# EAGLE design Netzteilplatine (EAGLE 7.7.0)
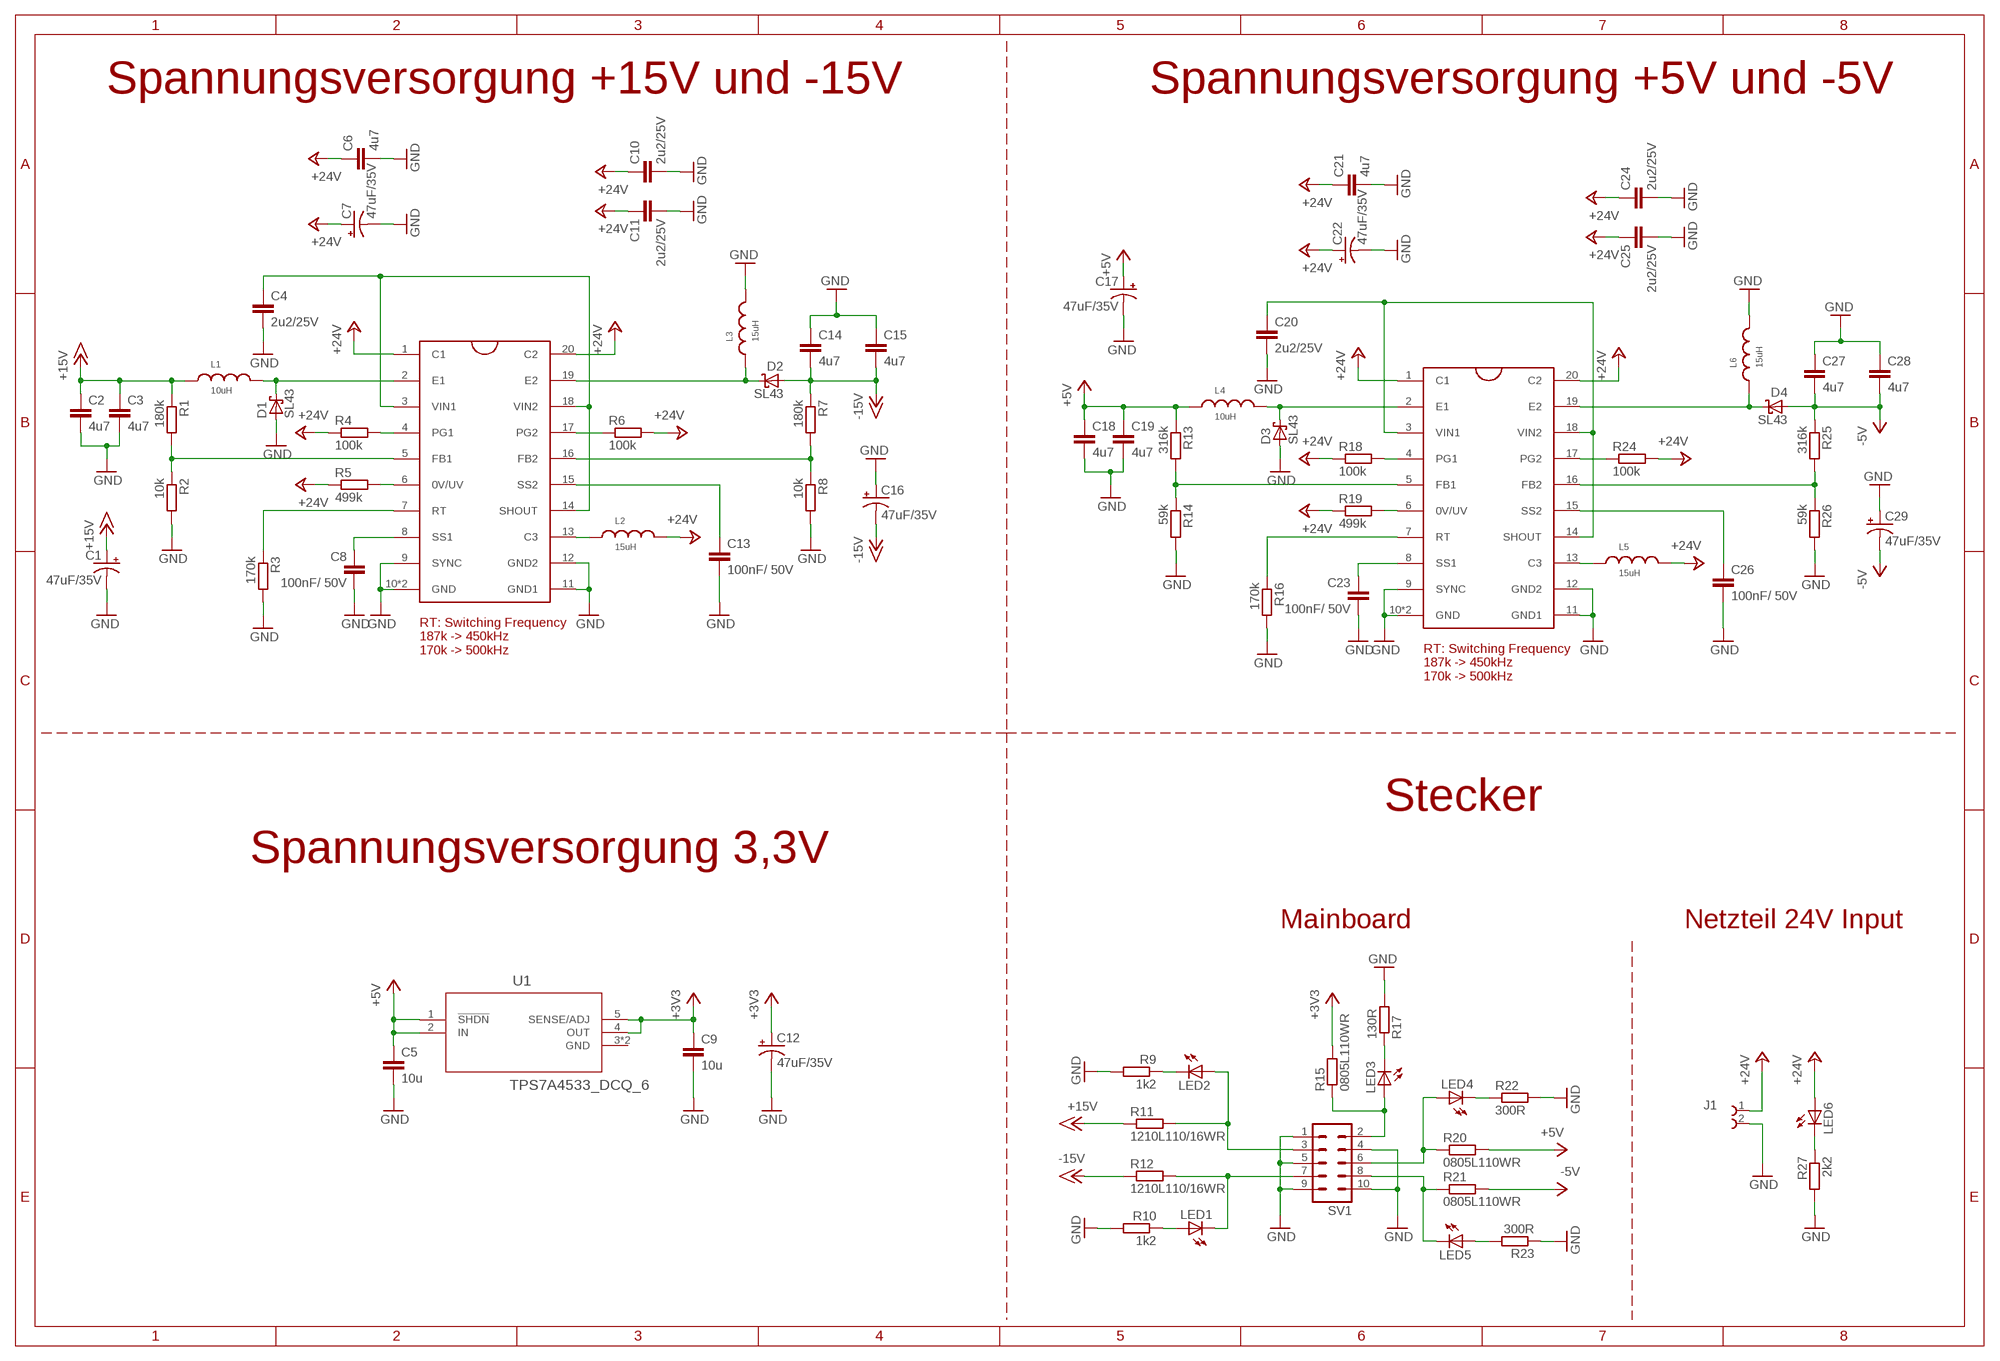
[diagram p0: schematic, sheet 1]

## Parts
C1  47uF/35V  CPOL-USD  [PANASONIC_D]
C2  4u7  C-EUC1210  [C1210]
C3  4u7  C-EUC1210  [C1210]
C4  2u2/25V  C-EUC1210  [C1210]
C5  10u  C-EUC0805  [C0805]
C6  4u7  C-EUC1210  [C1210]
C7  47uF/35V  CPOL-USD  [PANASONIC_D]
C8  100nF/ 50V  C-EUC0603  [C0603]
C9  10u  C-EUC0805  [C0805]
C10  2u2/25V  C-EUC1210  [C1210]
C11  2u2/25V  C-EUC1210  [C1210]
C12  47uF/35V  CPOL-USD  [PANASONIC_D]
C13  100nF/ 50V  C-EUC0603  [C0603]
C14  4u7  C-EUC1210  [C1210]
C15  4u7  C-EUC1210  [C1210]
C16  47uF/35V  CPOL-USD  [PANASONIC_D]
C17  47uF/35V  CPOL-USD  [PANASONIC_D]
C18  4u7  C-EUC1210  [C1210]
C19  4u7  C-EUC1210  [C1210]
C20  2u2/25V  C-EUC1210  [C1210]
C21  4u7  C-EUC1210  [C1210]
C22  47uF/35V  CPOL-USD  [PANASONIC_D]
C23  100nF/ 50V  C-EUC0603  [C0603]
C24  2u2/25V  C-EUC1210  [C1210]
C25  2u2/25V  C-EUC1210  [C1210]
C26  100nF/ 50V  C-EUC0603  [C0603]
C27  4u7  C-EUC1210  [C1210]
C28  4u7  C-EUC1210  [C1210]
C29  47uF/35V  CPOL-USD  [PANASONIC_D]
D1  SL43  SCHOTTKY-DIODESMC  [SMC]
D2  SL43  SCHOTTKY-DIODESMC  [SMC]
D3  SL43  SCHOTTKY-DIODESMC  [SMC]
D4  SL43  SCHOTTKY-DIODESMC  [SMC]
J1  691137810002  [691137810002]
L1  10uH  WE-PD_7332_PLASTIC_744778910  [WE-PD_7332-7345_PLASTIC_BASE]
L2  15uH  WE-PD2SR_7850_744787150  [WE-PD2SR_7850]
L3  15uH  WE-PD2SR_7850_744787150  [WE-PD2SR_7850]
L4  10uH  WE-PD_7332_PLASTIC_744778910  [WE-PD_7332-7345_PLASTIC_BASE]
L5  15uH  WE-PD2SR_7850_744787150  [WE-PD2SR_7850]
L6  15uH  WE-PD2SR_7850_744787150  [WE-PD2SR_7850]
LED1  LEDCHIPLED_0603  [CHIPLED_0603]
LED2  LEDCHIPLED_0603  [CHIPLED_0603]
LED3  LEDCHIPLED_0603  [CHIPLED_0603]
LED4  LEDCHIPLED_0603  [CHIPLED_0603]
LED5  LEDCHIPLED_0603  [CHIPLED_0603]
LED6  LEDCHIPLED_0603  [CHIPLED_0603]
R1  180k  R-EU_R0603  [R0603]
R2  10k  R-EU_R0603  [R0603]
R3  170k  R-EU_R0603  [R0603]
R4  100k  R-EU_R0603  [R0603]
R5  499k  R-EU_R0603  [R0603]
R6  100k  R-EU_R0603  [R0603]
R7  180k  R-EU_R0603  [R0603]
R8  10k  R-EU_R0603  [R0603]
R9  1k2  R-EU_R0603  [R0603]
R10  1k2  R-EU_R0603  [R0603]
R11  1210L110/16WR  R-EU_R1206  [R1206]
R12  1210L110/16WR  R-EU_R1206  [R1206]
R13  316k  R-EU_R0603  [R0603]
R14  59k  R-EU_R0603  [R0603]
R15  0805L110WR  R-EU_R0805  [R0805]
R16  170k  R-EU_R0603  [R0603]
R17  130R  R-EU_R0603  [R0603]
R18  100k  R-EU_R0603  [R0603]
R19  499k  R-EU_R0603  [R0603]
R20  0805L110WR  R-EU_R0805  [R0805]
R21  0805L110WR  R-EU_R0805  [R0805]
R22  300R  R-EU_R0603  [R0603]
R23  300R  R-EU_R0603  [R0603]
R24  100k  R-EU_R0603  [R0603]
R25  316k  R-EU_R0603  [R0603]
R26  59k  R-EU_R0603  [R0603]
R27  2k2  R-EU_R0603  [R0603]
SV1  ML10  [ML10]
U1  TPS7A4533_DCQ_6  [DCQ6]
U2  LT8471  [TSSOP20]
U3  LT8471  [TSSOP20]

## Nets
+3V3: C9.1 C12.+ R15.2 U1.4(OUT) U1.5(SENSE/ADJ)
+5V: C5.1 C17.+ C18.1 C19.1 L4.1 R13.1 R20.2 U1.1(!SHDN) U1.2(IN)
+15V: C1.+ C2.1 C3.1 L1.1 R1.1 R11.1
+24V: C6.1 C7.+ C10.1 C11.1 C21.1 C22.+ C24.1 C25.1 J1.1 L2.2 L5.2 LED6.A R4.1 R5.1 R6.2 R18.1 R19.1 R24.2 U2.1(C1) U2.20(C2) U3.1(C1) U3.20(C2)
-5V: C27.2 C28.2 C29.- D4.A R21.2 R25.1
-15V: C14.2 C15.2 C16.- D2.A R7.1 R12.1
GND: C1.- C2.2 C3.2 C4.2 C5.2 C6.2 C7.- C8.2 C9.2 C10.2 C11.2 C12.- C13.2 C14.1 C15.1 C16.+ C17.- C18.2 C19.2 C20.2 C21.2 C22.- C23.2 C24.2 C25.2 C26.2 C27.1 C28.1 C29.+ D1.A D3.A J1.2 L3.2 L6.2 R2.2 R3.2 R8.2 R9.2 R10.2 R14.2 R16.2 R17.2 R22.2 R23.1 R26.2 R27.2 SV1.1 SV1.4 SV1.5 SV1.9 SV1.10 U2.9(SYNC) U2.10(GND) U2.11(GND1) U2.12(GND2) U2.P$1(GND) U3.9(SYNC) U3.10(GND) U3.11(GND1) U3.12(GND2) U3.P$1(GND)
N$1: C4.1 U2.3(VIN1) U2.14(SHOUT) U2.18(VIN2)
N$2: R7.2 R8.1 U2.16(FB2)
N$3: R1.2 R2.1 U2.5(FB1)
N$4: R5.2 U2.6(0V/UV)
N$5: C20.1 U3.3(VIN1) U3.14(SHOUT) U3.18(VIN2)
N$6: C8.1 U2.8(SS1)
N$7: R19.2 U3.6(0V/UV)
N$8: C13.1 U2.15(SS2)
N$9: C23.1 U3.8(SS1)
N$10: C26.1 U3.15(SS2)
N$11: R25.2 R26.1 U3.16(FB2)
N$12: R13.2 R14.1 U3.5(FB1)
N$13: R3.1 U2.7(RT)
N$14: R16.1 U3.7(RT)
N$15: D1.C L1.2 U2.2(E1)
N$16: D2.C L3.1 U2.19(E2)
N$17: L2.1 U2.13(C3)
N$18: D3.C L4.2 U3.2(E1)
N$19: R6.1 U2.17(PG2)
N$20: R4.2 U2.4(PG1)
N$21: D4.C L6.1 U3.19(E2)
N$22: L5.1 U3.13(C3)
N$23: R24.1 U3.17(PG2)
N$24: R18.2 U3.4(PG1)
N$33: LED3.A R15.1 SV1.2
N$34: LED4.A R20.1 SV1.6
N$35: LED4.C R22.1
N$36: LED1.C R12.2 SV1.7
N$37: LED5.C R21.1 SV1.8
N$38: LED5.A R23.2
N$39: LED2.A R11.2 SV1.3
N$41: LED3.C R17.1
N$42: LED2.C R9.1
N$43: LED1.A R10.1
N$45: LED6.C R27.1

## Notes on the sheet
- Spannungsversorgung +15V und -15V | Spannungsversorgung +5V und -5V
- RT: Switching Frequency
  187k -> 450kHz
  170k -> 500kHz
- RT: Switching Frequency
  187k -> 450kHz
  170k -> 500kHz
- Stecker
- Spannungsversorgung 3,3V
- Mainboard | Netzteil 24V Input

## Power pins joined to a net without a drawn wire
GND: U1.3(GND) U1.P$1(GND)

## Library data of the parts
C1 C7 C12 C16 C17 C22 C29 = resistor:CPOL-US: POLARIZED CAPACITOR, American symbol
C2-C6 C8-C11 C13-C15 C18-C21 C23-C28 = resistor:C-EU: CAPACITOR, European symbol
D1-D4 = diode:SCHOTTKY-DIODE: Schottky Diode
J1 = TerminalBlocks (rev18a):691137810002: WR-TBL1 SERIE 1378 - 10.00 MM - HORIZONTAL CABLE ENTRY WITH PRESSURE CLAMP - GLOW WIRE PLASTIC - 2 pins <http://katalog.we-online.de/media/thumbs2/eican/thb_Con-TBL_Screw_PressureClamp_6911378100xx_pf2.jpg> Details see: http://katalog.we-online.de/en/em/TBL_10_00_1378_HORIZONTAL_ENTRY_W_PRESSURE_CLAMP_69113781000x Created on 2015-07-09 2015 (C) Wurth Elektronik
L1 L4 = PowerMagnetics (rev18d):WE-PD_7332_PLASTIC: SMD Shielded Power Inductor Characteristics Magnetically shielded version which results in a low leakage field High Saturation currents up to 25 A Very low self-losses at high switching frequency‘s Wide inductances spectrum available at all sizes Operating temperature: –40 °C to +125 °C Applications Perfectly suitable for switching regulators with extremely high efficiency Integrated DC/DC- converter Switching regulators with low operating voltages (Graphic cards, embedded PC-Cards, Mainboards) Plastic base: Because of the one piece construction these are more suitable for high vibration or shock applications <http://katalog.we-online.de/media/images/v2/Family_WE-PD.jpg> Details see: http://katalog.we-online.de/en/pbs/WE-PD? Updated by Dan Xu 2014-07-08 2014 (C) Wurth Elektronik; WE-NUMBER: 744778910/10uH
L2 L3 L5 L6 = PowerMagnetics (rev18e):WE-PD2SR_7850: SMD Shielded Power Inductor Characteristics Magnetic shielded version from the WE-PD2, which results in a low leakage field High saturation current due the self-centering shielding ring construction Pin compatible with the PD2 size 7850 Recommended solder profile: Reflow Operating temperature: –40 °C up to +125 °C Applications Switching regulators with low operation voltage like in portable devices <http://katalog.we-online.de/media/images/v2/Family_WE-PD2SR.jpg> Details see: http://katalog.we-online.de/en/pbs/WE-PD2SR? Updated by Dan Xu 2014-07-08 2014 (C) Wurth Elektronik; WE-NUMBER: 744787150/15uH
LED1-LED6 = led:LED: LED OSRAM: - CHIPLED LG R971, LG N971, LY N971, LG Q971, LY Q971, LO R971, LY R971 LH N974, LH R974 LS Q976, LO Q976, LY Q976 LO Q996 - Hyper CHIPLED LW Q18S LB Q993, LB Q99A, LB R99A - SideLED LS A670, LO A670, LY A670, LG A670, LP A670 LB A673, LV A673, LT A673, LW A673 LH A674 LY A675 LS A676, LA A676, LO A676, LY A676, LW A676 LS A679, LY A679, LG A679 - Hyper Micro SIDELED® LS Y876, LA Y876, LO Y876, LY Y876 LT Y87S - SmartLED LW L88C, LW L88S LB L89C, LB L89S, LG L890 LS L89K, LO L89K, LY L89K LS L896, LA L896, LO L896, LY L896 - TOPLED LS T670, LO T670, LY T670, LG T670, LP T670 LSG T670, LSP T670, LSY T670, LOP T670, LYG T670 LG T671, LOG T671, LSG T671 LB T673, LV T673, LT T673, LW T673 LH T674 LS T676, LA T676, LO T676, LY T676, LB T676, LH T676, LSB T676, LW T676 LB T67C, LV T67C, LT T67C, LS T67K, LO T67K, LY T67K, LW E67C LS E67B, LA E67B, LO E67B, LY E67B, LB E67C, LV E67C, LT E67C LW T67C LS T679, LY T679, LG T679 LS T770, LO T770, LY T770, LG T770, LP T770 LB T773, LV T773, LT T773, LW T773 LH T774 LS E675, LA E675, LY E675, LS T675 LS T776, LA T776, LO T776, LY T776, LB T776 LHGB T686 LT T68C, LB T68C - Hyper Mini TOPLED® LB M676 - Mini TOPLED Santana® LG M470 LS M47K, LO M47K, LY M47K Source: http://www.osram.convergy.de LUXEON: - LUMILED® LXK2-PW12-R00, LXK2-PW12-S00, LXK2-PW14-U00, LXK2-PW14-V00 LXK2-PM12-R00, LXK2-PM12-S00, LXK2-PM14-U00 LXK2-PE12-Q00, LXK2-PE12-R00, LXK2-PE12-S00, LXK2-PE14-T00, LXK2-PE14-U00 LXK2-PB12-K00, LXK2-PB12-L00, LXK2-PB12-M00, LXK2-PB14-N00, LXK2-PB14-P00, LXK2-PB14-Q00 LXK2-PR12-L00, LXK2-PR12-M00, LXK2-PR14-Q00, LXK2-PR14-R00 LXK2-PD12-Q00, LXK2-PD12-R00, LXK2-PD12-S00 LXK2-PH12-R00, LXK2-PH12-S00 LXK2-PL12-P00, LXK2-PL12-Q00, LXK2-PL12-R00 Source: www.luxeon.com KINGBRIGHT: KA-3528ASYC Source: www.kingbright.com
R1-R27 = resistor:R-EU_: RESISTOR, European symbol
SV1 = con-harting-ml:ML10: HARTING; OC_FARNELL: unknown; OC_NEWARK: unknown
U1 = wavegen:TPS7A4533_DCQ_6; MANUFACTURER_PART_NUMBER: tps7a4533_dcq_6; VENDOR: Texas Instruments
U2 U3 = wavegen:LT8471

## Board
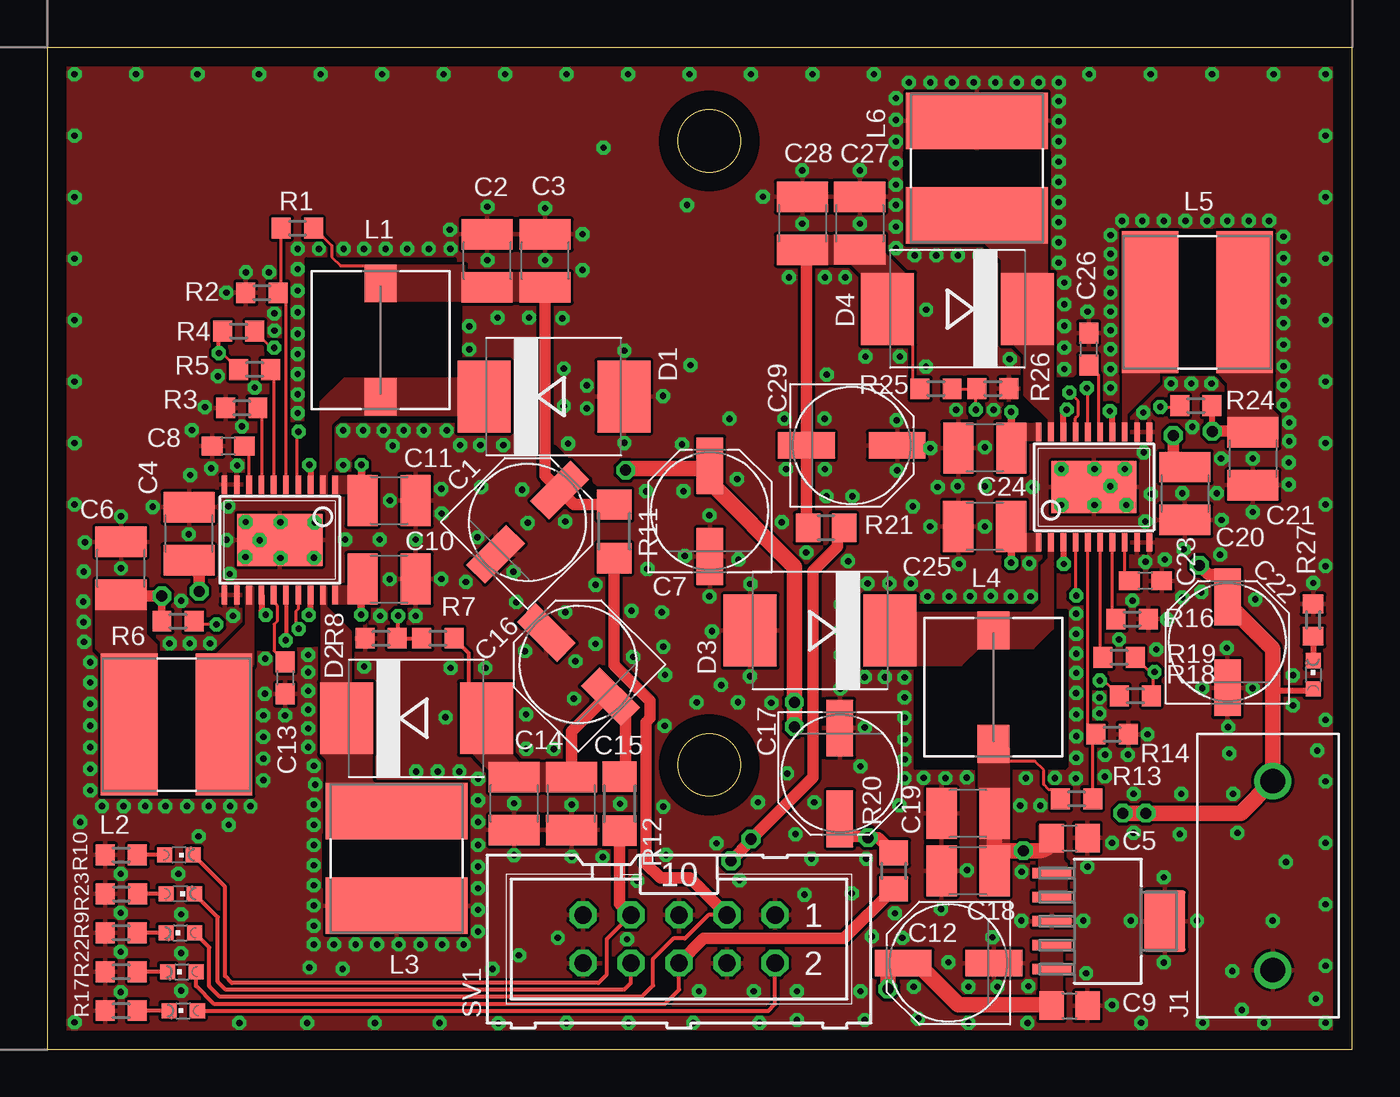
[diagram p1: board, top side]
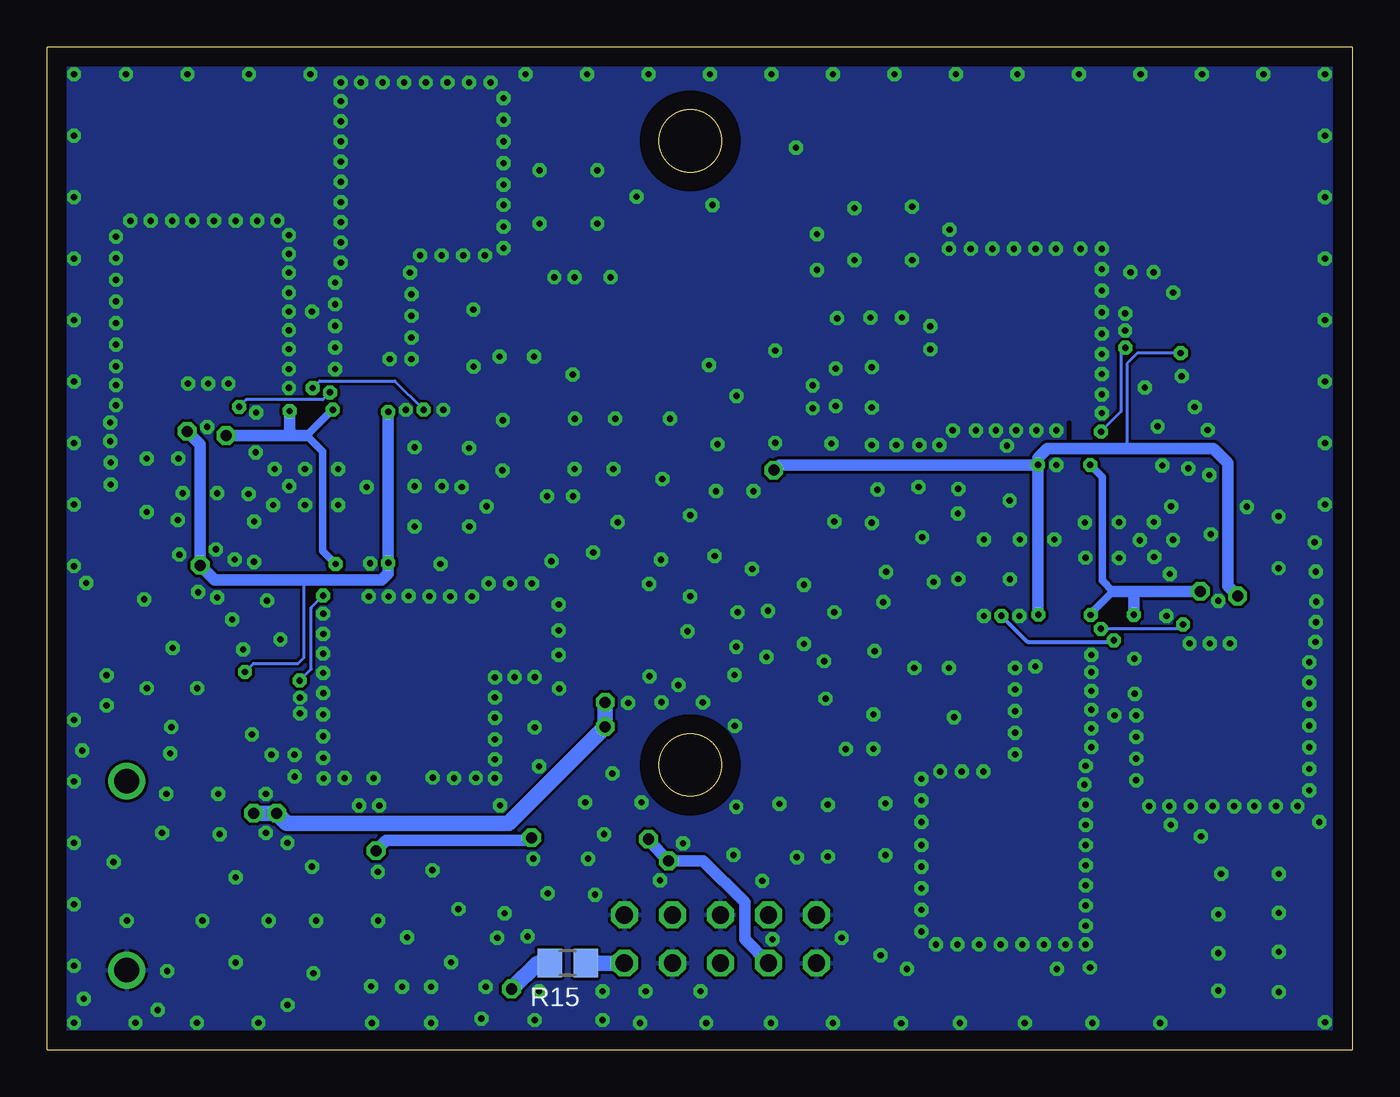
[diagram p2: board, bottom side, seen from below]

Size 69 x 53 mm. Coordinates in mm from the lower left corner, seen from the top.
Outline: 0,53 0,0 69,0 69,53 0,53
Outline: circle at 35,48.05 radius 1.65
Outline: circle at 35,15.05 radius 1.65
Copper layers (1*16): Top 0.035mm / dielectric 1.5mm / Bottom 0.035mm
Design rules "default *": minimum track width 6mil, minimum drill 0.3mm, track to track 6mil, track to pad 6mil, pad to pad 6mil, via to via 6mil, smd to smd 6mil, copper to edge 40mil, drill to drill 8mil, minimum pad ring 10mil, minimum via ring 8mil, stop-mask expansion 4mil, vias tented up to drill 0mil, thermal gap 6mil
tRestrict: 7 lines
bRestrict: 1 lines

### Footprints (pad centres in the part's own frame; a part is rotated, then mirrored left to right if it is on the bottom)
PANASONIC_D = smd 3 x 1.4: + 2.4,0; - -2.4,0
C1210 = smd 1.6 x 2.7: 1 -1.4,0; 2 1.4,0
C0805 = smd 1.3 x 1.5: 1 -0.95,0; 2 0.95,0
C0603 = smd 1.1 x 1: 1 -0.85,0; 2 0.85,0
SMC = smd 2.8 x 3.8: A 3.7,0; C -3.7,0
691137810002 = drill 1.3: 1 -5,0; 2 5,0
WE-PD_7332-7345_PLASTIC_BASE = smd 2 x 1.7: 1 -3,0; 2 3,0
WE-PD2SR_7850 = smd 3 x 7.5: 1 -2.5,0; 2 2.5,0
CHIPLED_0603 = smd 0.8 x 0.8: A 0,-0.75; C 0,0.75
R0603 = smd 1 x 1.1: 1 -0.85,0; 2 0.85,0
R1206 = smd 1.6 x 1.803: 1 -1.422,0; 2 1.422,0
R0805 = smd 1.3 x 1.5: 1 -0.95,0; 2 0.95,0
ML10 = drill 0.914 octagon: 1 -5.08,-1.27; 2 -5.08,1.27; 3 -2.54,-1.27; 4 -2.54,1.27; 5 0,-1.27; 6 0,1.27; 7 2.54,-1.27; 8 2.54,1.27; 9 5.08,-1.27; 10 5.08,1.27
DCQ6 = smd 0.559 x 2.057: 1 -2.54,-2.959; 2 -1.27,-2.959; 3 0,-2.959; 4 1.27,-2.959; 5 2.54,-2.959 | smd 3.25 x 2.2: P$1 0,3
TSSOP20 = smd 0.305 x 0.991: 1 -2.925,-2.918; 2 -2.275,-2.918; 3 -1.625,-2.918; 4 -0.975,-2.918; 5 -0.325,-2.918; 6 0.325,-2.918; 7 0.975,-2.918; 8 1.625,-2.918; 9 2.275,-2.918; 10 2.925,-2.918; 11 2.925,2.918; 12 2.275,2.918; 13 1.625,2.918; 14 0.975,2.918; 15 0.325,2.918; 16 -0.325,2.918; 17 -0.975,2.918; 18 -1.625,2.918; 19 -2.275,2.918; 20 -2.925,2.918 | smd 4.5 x 2.74: P$1 0,0

### Placement (x,y rotation side)
C1  25.4,27.89 45 top
C2  23.26,41.71 90 top
C3  26.33,41.71 90 top
C4  7.5,27.28 90 top
C5  54.05,11.18 0 top
C6  3.9,25.45 90 top
C7  35.03,28.47 90 top
C8  9.57,31.91 180 top
C9  54.05,2.32 0 top
C10  18.07,24.87 0 top
C11  18.08,29.04 0 top
C12  47.65,4.57 180 top
C13  12.58,19.65 270 top
C14  24.69,13 90 top
C15  27.71,13.01 90 top
C16  28.08,20.36 135 top
C17  41.91,14.6 270 top
C18  48.69,9.45 180 top
C19  48.69,12.48 180 top
C20  60.16,29.41 270 top
C21  63.75,31.24 270 top
C22  62.41,21.53 90 top
C23  58.07,24.79 0 top
C24  49.58,31.82 180 top
C25  49.57,27.66 180 top
C26  55.07,37.04 90 top
C27  42.96,43.69 270 top
C28  39.93,43.69 270 top
C29  42.54,31.95 0 top
D1  26.79,34.53 0 top
D2  19.52,17.52 0 top
D3  40.86,22.15 180 top
D4  48.13,39.16 180 top
J1  64.8,9.19 270 top
L1  17.62,37.52 270 top
L2  6.84,17.18 180 top
L3  18.47,10.11 270 top
L4  50.03,19.16 90 top
L5  60.81,39.52 0 top
L6  49.16,46.61 90 top
LED1  6.96,10.29 270 top
LED2  7.04,6.17 90 top
LED3  7.19,2.06 90 top
LED4  7.12,4.11 90 top
LED5  7.03,8.24 270 top
LED6  66.93,19.81 0 top
R1  13.22,43.43 180 top
R2  11.35,40.02 180 top
R3  10.29,33.93 180 top
R4  10.12,37.99 0 top
R5  10.96,35.96 0 top
R6  6.91,22.65 180 top
R7  20.65,21.75 180 top
R8  17.65,21.75 180 top
R9  3.92,6.17 180 top
R10  3.92,10.29 180 top
R11  29.98,27.4 270 top
R12  30.27,13 270 top
R13  54.43,13.26 0 top
R14  56.3,16.67 0 top
R15  41.48,4.57 180 bottom
R16  57.36,22.76 0 top
R17  3.92,2.06 180 top
R18  57.53,18.71 180 top
R19  56.67,20.74 180 top
R20  44.76,9.45 90 top
R21  41.18,27.58 180 top
R22  3.92,4.11 180 top
R23  3.92,8.23 0 top
R24  60.74,34.05 0 top
R25  47,34.94 0 top
R26  50,34.94 0 top
R27  66.93,22.71 90 top
SV1  33.4,5.84 180 top
U1  56.08,6.79 270 top
U2  12.3,26.95 180 top
U3  55.35,29.74 0 top

### Tracks (layer width: path | path; a pad name or v marks a point on that pad's centre or on a via)
+3V3  (via drill 0.6)
  Top 0.813: 53.02,2.4 C9.1 | 53.1,2.4 C9.1 | 53.1,2.67 C9.1 | C9.1 arc90 53.06,2.36 48.19,2.36 45.98,4.57 C12.+ 44.45,4.57 v44.45,3.2
  Bottom 0.813: R15.2 43.08,4.57 v44.45,3.2
  pour Top (no thermals): 53.64,2.17 53.64,5.67 52.58,5.67 52.58,1.86
+5V  (via drill 0.58)
  Top 0.152: R13.1 53.58,13.74 52.96,13.74 52.68,14.01 52.68,14.78 52.23,15.24 50.52,15.24 50.03,15.74 L4.1
  Top 0.61: 41.66,11 41.91,11.26 | 41.91,11.26 C17.+ | 41.91,11.26 43.33,11.26 v43.39,11.2 43.96,11.2 R20.2
  Top 0.813: 50.09,11.43 C18.1 50.09,10.52 v51.62,10.52 52.43,10.52 arc90 C5.1
  Bottom 0.61: v43.39,11.2 43.54,11.05 51.08,11.05 v51.62,10.52
  pour Top (no thermals): 50.81,14.87 50.81,8.48 49.37,8.48 49.37,13.74 49.27,13.85 49.27,13.98 49.25,17.07 50.8,17.07
  pour Top (no thermals): 53.87,9.1 53.87,7.96 52.5,7.96 52.5,11.85 53.67,11.85 53.67,10.02 53.86,9.83
+15V
  Top 0.152: L1.1 17.62,41.1 17.28,41.44 15.51,41.44 15.04,41.91 15.04,42.52 14.13,43.43 R1.1
  Top 0.61: C3.1 26.33,30.35 C1.+ 27.85,28.83 R11.1
  pour Top (isolate 0.203, no thermals): 17.17,39.59 17.17,41.44 22.01,41.44 22,41.04 27.18,41.05 27.2,39.6
+24V  (via drill 0.33, 0.58)
  Top 0.152: v9.07,36.83 9.25,36.83 R5.1 | R19.1 58.3,19.96 v58.55,19.96 58.47,19.89 58.47,18.8 R18.1
  Top 0.203: v9.07,36.83 9.07,37.79 R4.1
  Top 0.305: R24.2 61.59,32.7 v61.6,32.69 | LED6.A 66.93,18.97 64.8,18.97
  Top 0.406: v16.59,22.99 16.59,24.8 C10.1 | v16.61,30.92 16.61,29.1 C11.1 | R6.2 6.06,22.66 v6.06,23.98 | C24.1 v50.98,33.72 v50.97,33.72 | v50.97,25.73 C25.1
  Top 0.61: C11.1 | C6.1 3.97,23.98 v6.06,23.98 | 63.76,32.72 61.62,32.72 v61.6,32.69 | 62.41,24.41 C22.+ 62.41,24.87 62.15,25.13 61.38,25.13 v60.91,25.6 | C10.1
  Top 0.813: C22.+ 62.41,23.58 64.8,21.18 64.8,18.97 J1.1 63.1,12.5 v58.09,12.5 v56.87,12.5 | v39.5,17.07 v39.5,18.36 39.5,25.53 35.03,30 C7.+ 34.88,30.72 30.67,30.72 v30.59,30.63
  Bottom 0.152: v9.07,36.83 11.36,36.83 11.92,36.27 11.92,31.77 | v58.55,19.96 58.09,20.42 55.73,20.42 55.43,20.73 55.43,24.84
  Bottom 0.305: 16.61,31 v16.61,30.92
  Bottom 0.406: 16.61,23.01 v16.59,22.99
  Bottom 0.61: 16.61,23.01 v16.61,30.92 30.3,30.92 v30.59,30.63 | 16.61,31 16.61,31.27 16.11,31.77 11.92,31.77 7.34,31.77 6.58,31.01 6.58,24.51 v6.06,23.98 | v50.97,33.72 v50.97,25.73 50.97,25.18 51.31,24.84 55.43,24.84 60.15,24.84 v60.91,25.6 60.91,32 v61.6,32.69
  Bottom 0.813: v58.09,12.5 v56.87,12.5 56.34,11.96 44.61,11.96 v39.5,17.07 v39.5,18.36
  pour Top (no thermals): 15.24,30.29 15.24,29.45 16.18,29.45 16.18,28.31 17.29,28.31 17.29,30.29
  pour Top (isolate 0.152, no thermals): 15.19,24.45 15.19,23.61 17.27,23.61 17.27,25.76 16.26,25.76 16.26,24.45
  pour Top (isolate 0.203, no thermals): 4.45,16.61 2.91,16.6 2.91,20.89 2.62,21.18 2.62,24.31 2.85,24.31 5.16,24.54 5.17,24.53 5.17,21.99 5.74,21.41 5.74,17.3 5.21,16.76
  pour Top (no thermals): 50.4,28.42 50.4,26.4 52.5,26.4 52.5,27.24 51.65,27.24 51.65,28.42
  pour Top (no thermals): 50.4,31.24 50.4,33.08 52.44,33.08 52.44,32.24 51.62,32.24 51.62,31.24
  pour Top (no thermals): 65.03,32.31 62.48,32.31 62.48,35.22 61.88,35.82 61.88,39.97 62.48,39.97 62.82,40.31 64.73,40.31 64.73,35.38 64.72,33.83 65.03,33.53
-5V
  Top 0.152: D4.A 45.75,37.83 45.75,35.34 R25.1
  Top 0.61: C28.2 40.14,42.08 C29.- 40.14,27.67 R21.2
  pour Top (isolate 0.203, no thermals): 39.2,41.57 39.2,43.01 43.35,43.01 45.52,40.84 45.52,37.8 43.11,37.8 43.11,40.98 42.52,41.57
-15V
  Top 0.203: 24.18,18.67 23.22,17.7 D2.A 23.22,17.73 22.28,18.67 22.28,20.97 R7.1
  Top 0.61: C15.2 27.71,16.82 29.55,18.66 C16.- 30.59,17.85 30.59,14.74 R12.1
  pour Top (isolate 0.203, no thermals): 23.42,19.28 23.42,19.27 24.54,19.27 24.54,15.57 24.98,15.13 27.78,15.13 27.78,13.68 23.42,13.68 23.42,14.75 21.97,16.2 21.97,19.28
GND  (via drill 0.33)
  Top 0.61: v10.49,27.89 10.49,27.68 v11.23,26.93 10.47,26.18 v10.47,26.04 | v12.33,27.88 14.12,27.88 v14.14,27.86 | v12.33,25.99 14.08,25.99 v14.1,26.01 | v56.98,30.7 56.98,30.55 v56.21,29.79 57.05,28.95 v57.05,28.8 | v55.37,28.8 v53.62,28.8 | v53.62,30.7 v55.37,30.7
  other vias: 45.06,12.91 65.37,36.13 65.37,37.27 45.33,18.61 37.16,19.74 65.37,39.56 36.53,18.36 1.94,21.55 1.92,22.6 8.66,30.73 13.24,34.64 13.24,35.71 13.24,36.78 13.24,37.85 13.24,38.99 13.24,33.65 13.24,40.13 13.24,41.27 14.36,42.34 13.24,42.34 16.74,42.34 15.68,42.34 15.64,32.74 15.64,30.91 16.7,32.74 17.77,32.74 18.84,32.74 22.31,37.02 22.31,38.24 19.9,32.74 21.12,32.74 17.89,42.34 19.03,42.34 20.17,42.34 21.31,42.34 23.27,41.75 26.32,41.75 23.8,38.7 21.29,43.35 23.27,44.57 26.32,44.49 7.64,32.75 9.02,35.61 9.47,40.03 10.5,41.1 10.97,35.01 28.53,35.12 28.53,33.91 20.85,28.34 20.83,29.65 18.11,29.03 19.48,26.97 15.74,26.97 17.57,26.97 18.1,24.87 20.83,24.88 19.48,22.93 8.6,21.47 6.47,21.47 12.01,38.01 12.01,38.93 11.72,41.1 9.47,26.95 10.03,30.89 10.29,32.95 11.52,20.67 11.5,18.81 11.42,17.67 11.42,16.53 11.42,15.38 11.42,14.24 10.74,12.87 13.79,18.96 14.09,15 14.17,14.01 14.09,12.94 14.09,10.81 14.09,9.74 14.09,8.68 14.09,7.61 14.09,6.54 14.09,5.55 15.16,5.55 16.3,5.55 17.44,5.55 18.59,5.55 19.73,5.55 20.87,5.55 22.02,5.55 22.78,6.24 22.78,7.38 22.78,8.52 22.78,9.67 22.78,10.81 22.78,12.03 22.78,13.17 22.78,14.32 21.79,14.7 20.65,14.7 19.5,14.7 17.6,22.93 17.83,19.04 17.83,15.61 17.83,16.75 17.83,17.9 13.79,17.97 13.79,16.98 13.79,15.99 24.68,10.28 27.73,10.2 27.73,12.94 24.68,13.02 9.67,12.87 8.53,12.87 7.39,12.87 6.24,12.87 5.18,12.87 9.82,22.92 1.89,23.68 2.27,20.48 2.27,19.42 2.27,18.27 2.27,17.13 2.27,15.99 2.27,14.84 2.27,13.7 4.03,12.87 2.89,12.87 23.16,20.18 21.33,20.18 18.26,31.92 7.55,30.37 5.57,28.7 7.48,27.25 16.76,20.26 17.83,20.18 13.79,19.95 13.79,20.87 12.57,17.67 7.53,21.47 3.89,25.45 3.89,28.19 1.99,26.82 7.08,23.73 14.09,11.88 30.51,32.08 30.51,36.96 54.39,14.34 57.14,15.59 54.41,15.42 54.41,16.57 58.18,16.66 54.41,17.71 54.41,18.85 55.93,15.59 49.9,23.98 51.75,14.35 53.28,14.36 52,23.96 50.95,23.96 48.8,23.97 59.23,22.74 46.34,14.36 35.63,19.27 37.17,24.62 48.62,14.38 47.49,14.35 65.37,38.41 61.33,43.83 45.86,42 55,39.02 62.4,43.83 63.54,43.83 64.6,43.83 65.37,41.84 65.37,40.7 65.37,42.99 59.04,43.83 48.98,51.14 47,42 57.9,43.83 56.83,43.83 56.22,42.07 56.22,41.08 53.48,50.15 48.15,42 56.22,40.02 44.87,44.66 44.87,43.52 60.19,43.83 56.22,39.02 49.29,42 56.22,38.03 44.87,46.87 44.87,42.38 53.48,48.02 39.92,46.49 44.87,50.3 44.87,49.16 44.87,48.02 53.48,43.75 53.48,42.68 42.96,46.49 53.48,41.62 52.41,51.14 39.92,43.67 50.13,51.14 51.27,51.14 46.7,51.14 53.48,51.14 53.48,49.08 53.48,46.95 53.48,44.82 44.87,45.73 45.55,51.14 56.22,34.99 50.89,36.51 49.75,36.51 49.82,41.08 49.75,38.8 49.75,39.94 49.75,37.65 57.38,23.74 54.41,21.98 55.64,17.77 54.41,19.92 60.02,23.9 54.41,20.94 47.69,23.95 56.68,21.69 42.96,43.67 47.84,51.14 53.48,45.88 56.22,37.04 56.22,43.06 46.55,23.95 45.33,19.68 51.93,25.71 50.04,33.83 59.42,35.21 60.49,35.21 61.56,35.21 65.37,35.14 57.95,33.69 60.54,32.93 62.07,31.25 60.01,29.42 60.09,26.45 59.1,25.92 58.07,25.79 63.74,31.25 63.74,28.43 65.65,29.88 61.84,29.42 55.64,18.61 58.65,21.15 53.78,35.98 53.78,37.12 53.78,38.26 53.78,39.41 53.78,40.55 8.33,33.97 62.36,21.24 63.73,19.11 61.07,19.11 62.44,17.05 57.29,6.81 54.78,6.81 51.5,6.81 60.8,6.81 59.05,9.1 59.05,4.6 55.92,14.43 56.3,10.93 41.96,23.54 41.96,20.87 41.96,22.16 35.15,22.12 32.56,34.56 21.05,17.57 25.32,17.72 25.32,15.9 1.93,25.27 33.83,44.66 43.61,5.98 43,3.08 39.64,3.08 37.36,3.08 34.46,3.08 27.45,1.41 26.99,5.9 43.3,10.09 42.54,8.26 49.98,5.93 56.3,2.35 55.01,9.67 54.93,4.03 65.64,31.04 25.48,38.7 28.3,43.12 28.3,41.22 32.72,10.29 35.39,10.9 34.01,36.2 33.56,32 45.33,17.55 45.33,16.4 45.33,15.34 45.33,14.35 52.51,12.9 51.45,12.9 51.88,3.34 47.64,4.61 48.71,3.31 46.04,1.63 31.2,8.92 54.41,23.05 22.13,24.73 24.8,23.66 27.39,23.13 27.92,20.54 25.25,21.07 25.41,27.85 24.64,25.26 22.74,27.09 28.99,24.57 31.73,25.41 31.65,29.53 27.39,27.93 25.1,29.6 27.54,32.04 27.24,38.67 25.41,36.08 25.41,33.95 25.41,31.97 27.31,34.02 27.31,36 21.83,31.97 22.89,31.97 24.11,31.97 47.26,7.43 48.63,9.48 45.82,3.31 45.21,5.9 40.56,13.06 43,14.97 43.22,17.03 44.29,19.69 43.22,19.69 41.93,19.08 45.66,24.65 44.52,24.65 43.38,24.65 48.06,33.83 48.14,29.79 49.58,31.85 49.58,29.79 49.58,27.66 46.69,27.66 48.21,25.67 45.77,28.72 44.94,30.63 42.57,29.26 41.2,29.26 41.13,30.7 39.07,30.7 38.84,27.88 41.13,40.84 42.19,40.84 45.09,36.65 43.26,36.65 46.46,36.11 37.85,45.11 33.64,29.53 35.01,23.96 33.71,26.1 30.97,20.76 32.65,17.11 39.12,14.59 38.28,18.33 30.28,12.99 29.37,10.17 32.57,12.84 26.78,15.89 27.84,18.55 40.04,8.19 51.52,9.4 37.58,13.07 40.41,10.09 39.57,11.39 36.6,8.95 62.66,4.15 64.79,6.82 67.08,2.68 63.16,2.09 62.5,15.66 67.15,15.81 63.87,23.81 65.37,34.07 65.67,33.16 65.67,32.17 56.22,35.98 36.55,25.9 42.34,25.83 36.48,30.17 39.22,40.84 1.44,1.44 1.44,51.58 67.59,51.57 57.45,13.52 57.45,11.46 62.93,11.46 62.7,13.52 65.5,9.91 59.88,11.39 59.96,13.52 61.03,24.19 62.02,26.17 62.09,28 41.21,35.69 46.7,31.81 46.47,39.12 47.08,29.75 52.11,29.75 58.36,29.37 58.05,27.92 57.98,31.58 22.93,29.75 51.84,1.41 48.71,1.41 50.23,3.31 32.66,19.8 34.34,18.35 44.82,7.2 65.87,19.79 65.87,18.19 66.94,24.67 44.91,33.28 38.97,33.36 41.1,33.36 36.07,33.36 35.01,28.25 40.13,26.28 30.89,23.2 28.99,21.45 32.57,21.3 32.49,23.13 24.94,4.99 23.85,1.39 30.73,1.41 34.16,1.41 37.66,1.41 39.64,1.56 43.22,1.56 20.75,1.41 17.32,1.41 13.74,1.41 10.15,1.41 15.62,4.26 23.54,4.26 30.65,5.83 7.08,3.11 7.08,7.15 7.08,5.1 29.41,47.69 6.93,9.29 8,11.27 3.88,9.29 3.88,7.23 3.88,5.17 3.88,3.04 9.6,11.88 13.86,4.33 1.75,12.03 1.44,48.33 1.44,45.07 1.44,41.82 1.44,38.57 1.44,35.32 1.44,32.07 1.44,28.82 4.69,51.58 11.2,51.58 7.95,51.58 14.45,51.58 17.7,51.58 20.95,51.58 24.2,51.58 27.45,51.58 30.7,51.58 33.95,51.58 37.21,51.58 40.46,51.58 43.71,51.58 55.09,51.58 58.34,51.58 61.59,51.58 64.84,51.58 67.59,48.32 67.59,45.07 67.59,41.82 67.59,38.57 67.59,35.32 67.59,32.07 67.59,28.81 67.59,25.56 67.59,17.43 67.59,14.18 67.59,10.93 67.59,7.68 67.59,4.43 67.59,1.42 64.34,1.42 61.09,1.42 57.84,1.42 9.65,25.14 9.57,28.72
  pour Top (isolate 0.152, rank 3): -0.71,54.08 71.23,54.23 71.07,-1.73 -0.86,-1.88
  pour Bottom: -1.42,55.02 71.58,55.02 71.58,-1.98 -1.27,-1.98 -1.27,53.64
N$1  (via drill 0.33, 0.58)
  Top 0.305: U2.18 13.92,23.08 v13.83,22.99 | v13.86,30.91 13.92,30.85 U2.3 | U2.14 11.32,23.21 v11.54,22.99
  Top 0.61: v8.03,24.23 8.03,25.12 7.5,25.65 C4.1
  Bottom 0.406: 13.83,30.89 v13.86,30.91 13.21,30.27 13.21,24.79 12.65,24.23 13.83,23.06 v13.83,22.99
  Bottom 0.61: v8.03,24.23 11.54,24.23 | 11.54,24.23 12.65,24.23 | v11.54,22.99 11.54,24.23
N$2  (via drill 0.33)
  Top 0.203: v18.55,22.94 18.55,22.16 18.5,22.11 R8.1 R7.2 | U2.16 12.62,21.66 v12.6,21.64
  Bottom 0.203: v18.55,22.94 17.17,21.57 12.68,21.57 v12.6,21.64
N$3
  Top 0.152: U2.5 12.62,39.95 12.51,40.06 12.47,40.02 R2.1 12.37,40.2 R1.2
N$4
  Top 0.152: R5.2 11.97,35.8 U2.6
N$5  (via drill 0.33, 0.58)
  Top 0.305: U3.18 53.72,33.65 v53.9,33.83 | U3.14 56.32,33.62 v56.19,33.76 | U3.3 53.72,25.71 arc90 v53.75,25.68
  Top 0.61: v59.54,32.46 59.54,30.81 C20.1
  Bottom 0.406: v53.9,33.83 55.27,32.46 54.44,31.62 54.44,26.36 v53.75,25.68
  Bottom 0.61: 55.27,32.46 56.34,32.46 | 56.34,32.46 v59.54,32.46 | v56.19,33.76 56.19,32.61 56.34,32.46
N$6
  Top 0.152: U2.8 10.67,31.66 C8.1
N$7
  Top 0.152: R19.2 55.67,20.89 U3.6
N$8
  Top 0.152: U2.15 11.97,23.64 12.15,23.47 12.15,22.63 11.99,22.48 11.99,21.08 C13.1
N$9
  Top 0.152: C23.1 56.97,25.04 U3.8
N$10
  Top 0.152: U3.15 55.59,32.73 55.59,35.67 C26.1
N$11  (via drill 0.33)
  Top 0.152: U3.16 55.02,34.92 v54.97,34.98 | 49.18,34.92 R26.1 49.1,34.9 | v49.1,33.83 49.1,34.9 | 49.1,34.9 47.85,34.9 R25.2
  Bottom 0.152: v54.97,34.98 54.59,35.36 50.63,35.36 v49.1,33.83
N$12
  Top 0.152: R13.2 55.28,16.5 R14.1 55.02,17.11 U3.5
N$13
  Top 0.152: R3.1 11.32,33.93 U2.7
N$14
  Top 0.152: R16.1 56.32,22.95 U3.7
N$15
  pour Top (isolate 0.152, no thermals): 14.49,34.21 14.49,29.45 14.58,29.45 14.75,29.45 14.76,30.56 14.96,30.76 14.96,33.06 15.48,33.59 15.5,33.59 24.34,33.6 24.34,35.44 15.73,35.44
N$16
  pour Top (isolate 0.203, no thermals): 14.72,24.45 14.5,24.45 14.49,15.63 14.8,15.33 14.8,11.51 19.38,11.51 19.38,13.79 17.56,13.79 17.14,14.21 17.14,18.32 16.03,19.35 16.03,22.1 14.74,23.39 14.74,24.45
N$17
  pour Top (isolate 0.203, no thermals): 10.85,24.46 10.85,20.35 10.76,20.26 10.76,14.04 8.18,14.02 8.18,20.65 8.64,20.57 10.54,22.48 10.54,24.46
N$18
  pour Top (no thermals): 49.41,23.01 49.48,23.08 52.07,23.08 52.61,23.62 52.61,25.6 52.99,25.99 52.99,27.02 53.15,27.02 53.15,22.26 52.12,21.23 49.22,21.23 48.32,20.33 43.92,20.33 43.92,23.47 44.3,23.09 49.32,23.09
N$19  (via drill 0.33)
  Top 0.152: U2.17 13.27,23.3 13.14,23.16 13.14,22.4 v13.29,22.25 | v8.94,22.48 7.76,22.48 R6.1
  Bottom 0.152: v8.94,22.48 9.17,22.25 v13.29,22.25
N$20  (via drill 0.33)
  Top 0.152: U2.4 13.21,29.93 13.21,32.6 v13.28,32.67 | R4.2 11.85,37.11 v11.99,37.11
  Bottom 0.152: v11.99,37.11 12.22,36.88 12.22,33.73 v13.28,32.67
N$21
  pour Top (no thermals): 50.85,37.57 50.5,37.57 50.5,41.73 49.41,42.82 48.11,42.82 48.11,44.35 52.84,44.35 52.84,37.57 53.15,37.25 53.15,32.42 52.98,32.42 52.98,33.31 51.69,34.59 51.69,36.73
N$22
  pour Top (no thermals): 58.86,39.78 56.9,39.78 56.9,32.61 57.05,32.61 57.05,33.63 58.78,35.36 58.78,39.01
N$23  (via drill 0.33)
  Top 0.152: U3.17 54.37,33.39 54.51,33.53 54.51,34.29 v54.06,34.75 | v58.86,33.98 59.82,33.98 R24.1
  Bottom 0.152: v54.06,34.75 54.44,34.37 58.47,34.37 v58.86,33.98
N$24  (via drill 0.33)
  Top 0.152: R18.2 55.88,19.51 v55.66,19.51 | U3.4 54.37,24.04 v54.41,24
  Bottom 0.152: v55.66,19.51 55.05,20.12 55.05,23.36 v54.41,24
N$25
  cutout Top (rank 3): 21.55,41.77 21.55,41.61 16.79,41.61 16.79,39.43 21.86,39.43 21.86,35.66 15.65,35.66 14.28,34.29 14.28,33.21 13.69,33.21 13.69,41.82 21.55,41.82
N$26
  cutout Top (rank 3): 15.42,33.22 21.52,33.22 21.52,33.38 15.57,33.38
N$27
  cutout Top: 7.95,21.01 5.9,21.01 5.9,13.36 7.95,13.36
N$28
  cutout Top: 22.29,11.38 14.6,11.36 14.6,8.58 22.29,8.6
N$29
  cutout Top: 45.33,47.48 52.99,47.47 52.99,45.72 45.33,45.73
N$30
  cutout Top: 59.99,43.34 61.67,43.34 61.67,35.69 59.99,35.69
N$31
  cutout Top: 45.9,14.86 45.9,20.04 48.49,20.04 49.33,20.88 52.15,20.88 53.45,22.17 53.45,23.24 53.9,23.24 53.9,14.94 53.83,14.86 51.01,14.86 51.01,14.94 51.08,15.01 51.08,17.37 48.95,17.37 48.95,14.86
N$32
  cutout Top: 46.13,23.39 52,23.39 52,23.47 46.13,23.47
N$33
  Top 0.203: 8.04,2.06 LED3.A 7.94,2.03 38.1,2.03 38.49,2.41 SV1.2
  Bottom 0.813: R15.1 SV1.2
N$34
  Top 0.203: SV1.6 33.41,3.17 32.64,2.4 8.83,2.4 7.87,3.37 LED4.A
  Top 0.61: SV1.6 34.7,5.87 42.13,5.87 R20.1
N$35
  Top 0.203: LED4.C R22.1
N$36
  Top 0.203: SV1.7 29.6,5.84 29.6,3.98 29.14,3.53 9.76,3.53 9.4,3.89 9.4,8.6 LED1.C
  Top 0.61: R12.2 30.27,7.71 SV1.7
N$37  (via drill 0.58)
  Top 0.203: SV1.8 30.87,3.52 30.51,3.17 9.44,3.17 9.02,3.58 9.02,7 LED5.C
  Top 0.305: R21.1 42.13,27.94
  Top 0.61: v37.22,11.12 40.49,14.4 40.49,25.3 41.78,26.59 41.78,26.95 42.13,27.3 R21.1 | v36.15,9.98 37.22,11.05
  Bottom 0.61: v37.22,11.12 37.22,11.05 v36.15,9.98 34.32,9.98 32.11,7.77 32.11,5.82 SV1.8
N$38
  Top 0.203: LED5.A R23.2
N$39
  Top 0.203: SV1.3 34.95,7.11 33.71,5.87 33.1,5.87 32.03,4.8 32.03,3.39 31.43,2.79 9.13,2.79 8.56,3.35 8.56,5.4 LED2.A
  Top 0.61: SV1.3 33.99,9.07 32.41,9.07 31.65,9.83 31.65,17.3 31.88,17.53 31.88,18.44 29.98,20.34 R11.2
N$41
  Top 0.203: LED3.C R17.1
N$42
  Top 0.203: LED2.C R9.1
N$43
  Top 0.203: LED1.A R10.1
N$45
  Top 0.305: R27.1 LED6.C

### Text on the board
tDocu: -15V | -5V | -15V | +5V | +3V3